# Altium project Booster_Main_Board.PrjPcb (part 4 of 4)

## Sheet TEMP_MGT.SchDoc: Temperature
size 420 x 297 mm; Author: G.K.; CompanyName: WUT; DrawnBy: G.K.; Organization: WUT; Address1: Warsaw Univeristy of Technology; Address2: Nowowiejska 15/19; DocumentNumber: 6; Revision: 1.6.2; SheetNumber: 6; SheetTotal: 6; EDA_Number: ARTIQ; Projet: Booster RF Power Amplifier; ModifiedBy: -; CreateDate: XX/XX/XXXX; CheckedDate: -; Title2: Management 1.6.2; DivGrp: ISE; Designer: G.K.; ModifiedDate: -; ProjectName: Booster RF Power Amplifier
Used 3 times, as channels U_Booster_TOP/U_TEMP_MGT1, U_Booster_TOP/U_TEMP_MGT2, U_Booster_TOP/U_TEMP_MGT3. Parts and nets are listed once, with the designators drawn on the sheet.
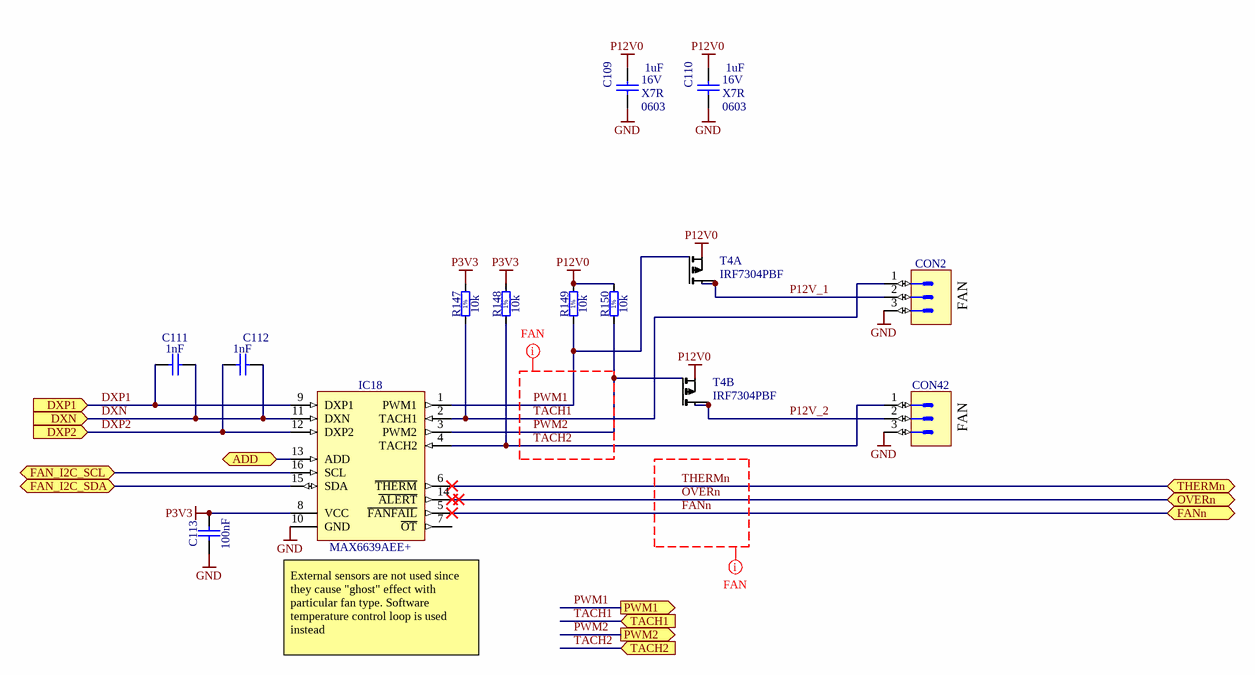
[diagram p5: TEMP_MGT.SchDoc]

### Parts
C109  1uF  Voltage: 16V  TC: X7R  Case: 0603  [CAPC1608X87N]
C110  1uF  Voltage: 16V  TC: X7R  Case: 0603  [CAPC1608X87N]
C111  1nF  [CAPC1608X87N]
C112  1nF  [CAPC1608X87N]
C113  100nF  [CAPC1005X55N]
CON2  KK®  [MOLEX_22-05-7038]  (value not drawn)
CON42  KK®  [MOLEX_22-05-7038]  (value not drawn)
IC18  MAX6639AEE+  [SOP63P600X175-16N]
R147  10k  [RESC1005X40N]
R148  10k  [RESC1005X40N]
R149  10k  [RESC1005X40N]
R150  10k  [RESC1005X40N]
T4  IRF7304PBF  [so-8]  (parts A,B of 2)

### Ports
ADD (bidir), DXN (in), DXP1 (in), DXP2 (in), FAN_I2C_SCL (bidir), FAN_I2C_SDA (bidir), FANn (bidir), OVERn (bidir), PWM1 (out), PWM2 (out), TACH1 (in), TACH2 (in), THERMn (bidir)

### Nets
GND: C109.1 C110.1 C113.1 CON2.3 CON42.3 IC18.10(GND)
P3V3: C113.2 IC18.8(VCC) R147.2 R148.2
P12V0: C109.2 C110.2 R149.2 R150.2 T4.1(S1) T4.3(S2)
ADD: IC18.13(ADD) ; port ADD
DXN: C111.1 C112.1 IC18.11(DXN) ; port DXN
DXP1: C111.2 IC18.9(DXP1) ; port DXP1
DXP2: C112.2 IC18.12(DXP2) ; port DXP2
FAN_I2C_SCL: IC18.16(SCL) ; port FAN_I2C_SCL
FAN_I2C_SDA: IC18.15(SDA) ; port FAN_I2C_SDA
FANn: IC18.5(~{FANFAIL}) ; port FANn
OVERn: IC18.14(~{ALERT}) ; port OVERn
P12V_1: CON2.2 T4.7(D1) T4.8(D1)
P12V_2: CON42.2 T4.5(D2) T4.6(D2)
PWM1: IC18.1(PWM1) R149.1 T4.2(G1) ; port PWM1
PWM2: IC18.3(PWM2) R150.1 T4.4(G2) ; port PWM2
TACH1: CON2.1 IC18.2(TACH1) R147.1 ; port TACH1
TACH2: CON42.1 IC18.4(TACH2) R148.1 ; port TACH2
THERMn: IC18.6(~{THERM}) ; port THERMn

Not connected (* = marked no-connect by the designer): IC18 7(~{OT})

### Channels
U_Booster_TOP/U_TEMP_MGT1: designators end in _1; ports ADD=NetIC18_1_13 DXN=DXN DXP1=DXP1 DXP2=DXP2 FAN_I2C_SCL=NetIC18_1_16 FAN_I2C_SDA=NetIC18_1_15 FANn=FANn OVERn=OVERn PWM1=PWM1 PWM2=PWM2 TACH1=TACH1 TACH2=TACH2 THERMn=THERMn
U_Booster_TOP/U_TEMP_MGT2: designators end in _2; ports ADD=NetIC18_1_13 DXN=DXN DXP1=DXP1 DXP2=DXP2 FAN_I2C_SCL=NetIC18_1_16 FAN_I2C_SDA=NetIC18_1_15 FANn=FANn OVERn=OVERn PWM1=PWM1 PWM2=PWM2 TACH1=TACH1 TACH2=TACH2 THERMn=THERMn
U_Booster_TOP/U_TEMP_MGT3: designators end in _3; ports ADD=NetIC18_1_13 DXN=DXN DXP1=DXP1 DXP2=DXP2 FAN_I2C_SCL=NetIC18_1_16 FAN_I2C_SDA=NetIC18_1_15 FANn=FANn OVERn=OVERn PWM1=PWM1 PWM2=PWM2 TACH1=TACH1 TACH2=TACH2 THERMn=THERMn

### Layout directives
net class FAN: FANn, OVERn, PWM1, PWM2, TACH1, TACH2, THERMn

### Notes on the sheet
- (near CON2) FAN
- (near CON42) FAN
- (near IC18) External sensors are not used since they cause "ghost" effect with particular fan type. Software temperature control loop is used instead
- Project/Equipment
- Document
- Designer
- Drawn by
- Check.by
- File
- Last Mod.
- Print Date
- Sheet
- Size
- A3
- of
- Rev
- (in symbol R0402_10K_1%_0.0625W_100PPM) 1%

### Library data of the parts
C109 C110 = CC0603_1UF_16V_10%_X7R: Non-polarised capacitor; Part Description: SMD Multilayer Chip Ceramic Capacitor; Manufacturer: GENERIC; Manufacturer1 Part Number: 223824613663; Tolerance: ±10%; Table: Capacitors SMD; Part Number: CC0603_1UF_16V_10%_X7R; Component Kind: Standard; Component Type: Standard; Pin Count: 2; Value: 1uF; Status: Preferred; Manufacturer Part Number: CC0603_1uF_16V_10%_X7R; Mounted: Yes; Socket: No; SMD: Yes; Manufacturer1 Example: PHYCOMP; Manufacturer1 ComponentHeight: 0.87mm; HelpURL: \\cern.ch\dfs\Applications\Altium\Datasheets\CC0805_X5R_PHYCOMP_HC.pdf; Author: CERN DEM JLC; CreateDate: 12/3/2007; LatestRevisionDate: 12/3/2007
C111 C112 = CC0603_1NF_50V_10%_X7R: Non-polarised capacitor; Part Description: SMD Multilayer Chip Ceramic Capacitor; Manufacturer: GENERIC; Manufacturer1 Part Number: 223858615623; Voltage: 50V; TC: X7R; Tolerance: ±10%; Table: Capacitors SMD; Part Number: CC0603_1NF_50V_10%_X7R; Component Kind: Standard; Component Type: Standard; Pin Count: 2; Value: 1nF; Status: Preferred; Manufacturer Part Number: CC0603_1NF_50V_10%_X7R; Case: 0603; Mounted: Yes; Socket: No; SMD: Yes; Manufacturer1 Example: PHYCOMP; Manufacturer1 ComponentHeight: 0.87mm; HelpURL: \\cern.ch\dfs\Applications\Altium\Datasheets\CC0603_X7R_PHYCOMP.pdf; Author: CERN DEM JLC; CreateDate: 2007-12-03; LatestRevisionDate: 2007-12-03
C113 = CC0402_100NF_16V_10%_X7R: Non-polarised capacitor; Part Description: SMD Multilayer Chip Ceramic Capacitor; Manufacturer: GENERIC; Manufacturer1 Part Number: GRM155R71C104KA88D; Voltage: 16V; TC: X7R; Tolerance: ±10%; Part Number: CC0402_100NF_16V_10%_X7R; Component Kind: Standard; Component Type: Standard; Pin Count: 2; Value: 100nF; Status: Not Recommended; Manufacturer Part Number: CC0402_100NF_16V_10%_X7R; Case: 0402; Mounted: Yes; Socket: No; SMD: Yes; Manufacturer1 Example: MURATA; Manufacturer1 ComponentHeight: 0.55mm; HelpURL: \\cern.ch\dfs\Applications\Altium\Datasheets\CC0402_X7R_MURATA_GRM.pdf; Author: CERN DEM JLC; CreateDate: 05.12.2013; LatestRevisionDate: 03.12.2007; Sense: No
CON2 CON42 = MOLEX_22-05-7038: Connector 3 Male; Part Description: 2.54mm (.100") Pitch KK® Wire-To-Board Header, Right Angle, With Friction Lock, 3 Circuits; Manufacturer: MOLEX; PressFit: No; Part Number: MOLEX_22-05-7038; Component Kind: Standard; Component Type: Standard; Pin Count: 3; Family: KK®; Mounted: Yes; Socket: No; SMD: No; Sense: No; Status: None; Manufacturer Part Number: 22-05-7038; ComponentHeight: 5.8mm; HelpURL: \\cern.ch\dfs\Applications\Altium\Datasheets\MOLEX_22-05-7038.pdf; Author: CERN DEM JLC; CreateDate: 19/09/2012; LatestRevisionDate: 19/09/2012
IC18 = MAX6639AEE+: 2-Channel Temperature Monitor with Dual, Automatic, PWM Fan-Speed Controller; Manufacturer: MAXIM; Table: Analog & Interface; Part Number: MAX6639AEE+; Component Kind: Standard; Component Type: Standard; Device: MAX6639AEE+; PackageDescription: SOP, 0.635mm pitch; 16 pin, 3.9mm W X 4.895mm L X 1.75mm H Body, IPC Medium Density; Part Description: 2-Channel Temperature Monitor with Dual, Automatic, PWM Fan-Speed Controller; Manufacturer Part Number: MAX6639AEE+; Pin Count: 16; Case: SSOP16; Mounted: Yes; Socket: No; SMD: Yes; ComponentHeight: 1.75mm; Author: CERN DEM JLC; HelpURL: \\cern.ch\dfs\Applications\Altium\Datasheets\MAX6639AEE+.pdf; CreateDate: 2012-08-15; LatestRevisionDate: 2012-08-15
R147-R150 = R0402_10K_1%_0.0625W_100PPM: Resistor - 1%; Part Description: General Purpose Thick Film Chip Resistor; Manufacturer: GENERIC; Manufacturer1 Part Number: 232270671003L; TC: ±100ppm/°C; Table: Resistors SMD; Part Number: R0402_10K_1%_0.0625W_100PPM; Component Kind: Standard; Component Type: Standard; Pin Count: 2; Value: 10k; Status: Not recommended; Power: 0.0625W; Tolerance: ±1%; Manufacturer Part Number: R0402_10K_1%_0.0625W_100PPM; Case: 0402; Mounted: Yes; Socket: No; SMD: Yes; Manufacturer1 Example: YAGEO PHYCOMP; Manufacturer1 ComponentHeight: 0.4mm; HelpURL: \\cern.ch\dfs\Applications\Altium\Datasheets\R0402_Phycomp_RC0402.pdf; Author: CERN DEM JLC; CreateDate: 2007-12-03; LatestRevisionDate: 2012-10-17
T4 = Q_IRF7304: dual PMOS   20V 4,3A 2,0W 0,09R; Manufacturer Part Number: IRF7304PBF

## Nets that join several sheets
GND: Booster_Main_Board (40 pins), CPU (44 pins), U_Booster_TOP/U_PA_Channel (69 pins), U_Booster_TOP/U_PA_Channel (69 pins), U_Booster_TOP/U_PA_Channel (69 pins), U_Booster_TOP/U_PA_Channel (69 pins), U_Booster_TOP/U_PA_Channel (69 pins), U_Booster_TOP/U_PA_Channel (69 pins), U_Booster_TOP/U_PA_Channel (69 pins), U_Booster_TOP/U_PA_Channel (69 pins), Power_Supply (76 pins), U_Booster_TOP/U_TEMP_MGT1 (6 pins), U_Booster_TOP/U_TEMP_MGT2 (6 pins), U_Booster_TOP/U_TEMP_MGT3 (6 pins)
N8V0: U_Booster_TOP/U_PA_Channel (C84_1.1 IC23_1.2 IC23_1.4), U_Booster_TOP/U_PA_Channel (C84_2.1 IC23_2.2 IC23_2.4), U_Booster_TOP/U_PA_Channel (C84_3.1 IC23_3.2 IC23_3.4), U_Booster_TOP/U_PA_Channel (C84_4.1 IC23_4.2 IC23_4.4), U_Booster_TOP/U_PA_Channel (C84_5.1 IC23_5.2 IC23_5.4), U_Booster_TOP/U_PA_Channel (C84_6.1 IC23_6.2 IC23_6.4), U_Booster_TOP/U_PA_Channel (C84_7.1 IC23_7.2 IC23_7.4), U_Booster_TOP/U_PA_Channel (C84_8.1 IC23_8.2 IC23_8.4), Power_Supply (C31.2 L4.2 R91.2 R108.1)
P3V3: Booster_Main_Board (38 pins), CPU (43 pins), U_Booster_TOP/U_PA_Channel (10 pins), U_Booster_TOP/U_PA_Channel (10 pins), U_Booster_TOP/U_PA_Channel (10 pins), U_Booster_TOP/U_PA_Channel (10 pins), U_Booster_TOP/U_PA_Channel (10 pins), U_Booster_TOP/U_PA_Channel (10 pins), U_Booster_TOP/U_PA_Channel (10 pins), U_Booster_TOP/U_PA_Channel (10 pins), Power_Supply (18 pins), U_Booster_TOP/U_TEMP_MGT1 (C113_1.2 IC18_1.8 R147_1.2 R148_1.2), U_Booster_TOP/U_TEMP_MGT2 (C113_2.2 IC18_2.8 R147_2.2 R148_2.2), U_Booster_TOP/U_TEMP_MGT3 (C113_3.2 IC18_3.8 R147_3.2 R148_3.2)
P5V0: U_Booster_TOP/U_PA_Channel (F1_1.1), U_Booster_TOP/U_PA_Channel (F1_2.1), U_Booster_TOP/U_PA_Channel (F1_3.1), U_Booster_TOP/U_PA_Channel (F1_4.1), U_Booster_TOP/U_PA_Channel (F1_5.1), U_Booster_TOP/U_PA_Channel (F1_6.1), U_Booster_TOP/U_PA_Channel (F1_7.1), U_Booster_TOP/U_PA_Channel (F1_8.1), Power_Supply (9 pins)
P6V5: U_Booster_TOP/U_PA_Channel (C78_1.1 C89_1.1 IC13_1.2 IC21_1.2), U_Booster_TOP/U_PA_Channel (C78_2.1 C89_2.1 IC13_2.2 IC21_2.2), U_Booster_TOP/U_PA_Channel (C78_3.1 C89_3.1 IC13_3.2 IC21_3.2), U_Booster_TOP/U_PA_Channel (C78_4.1 C89_4.1 IC13_4.2 IC21_4.2), U_Booster_TOP/U_PA_Channel (C78_5.1 C89_5.1 IC13_5.2 IC21_5.2), U_Booster_TOP/U_PA_Channel (C78_6.1 C89_6.1 IC13_6.2 IC21_6.2), U_Booster_TOP/U_PA_Channel (C78_7.1 C89_7.1 IC13_7.2 IC21_7.2), U_Booster_TOP/U_PA_Channel (C78_8.1 C89_8.1 IC13_8.2 IC21_8.2), Power_Supply (9 pins)
P12V0: Power_Supply (11 pins), U_Booster_TOP/U_TEMP_MGT1 (6 pins), U_Booster_TOP/U_TEMP_MGT2 (6 pins), U_Booster_TOP/U_TEMP_MGT3 (6 pins)
P30V0: U_Booster_TOP/U_PA_Channel (C32_1.2 R17_1.2 R114_1.1 U1_1.1), U_Booster_TOP/U_PA_Channel (C32_2.2 R17_2.2 R114_2.1 U1_2.1), U_Booster_TOP/U_PA_Channel (C32_3.2 R17_3.2 R114_3.1 U1_3.1), U_Booster_TOP/U_PA_Channel (C32_4.2 R17_4.2 R114_4.1 U1_4.1), U_Booster_TOP/U_PA_Channel (C32_5.2 R17_5.2 R114_5.1 U1_5.1), U_Booster_TOP/U_PA_Channel (C32_6.2 R17_6.2 R114_6.1 U1_6.1), U_Booster_TOP/U_PA_Channel (C32_7.2 R17_7.2 R114_7.1 U1_7.1), U_Booster_TOP/U_PA_Channel (C32_8.2 R17_8.2 R114_8.1 U1_8.1), Power_Supply (5 pins)
REF_P3V3: U_Booster_TOP/U_PA_Channel (C60_1.2 IC15_1.3 R89_1.2 T5_1.2), U_Booster_TOP/U_PA_Channel (C60_2.2 IC15_2.3 R89_2.2 T5_2.2), U_Booster_TOP/U_PA_Channel (C60_3.2 IC15_3.3 R89_3.2 T5_3.2), U_Booster_TOP/U_PA_Channel (C60_4.2 IC15_4.3 R89_4.2 T5_4.2), U_Booster_TOP/U_PA_Channel (C60_5.2 IC15_5.3 R89_5.2 T5_5.2), U_Booster_TOP/U_PA_Channel (C60_6.2 IC15_6.3 R89_6.2 T5_6.2), U_Booster_TOP/U_PA_Channel (C60_7.2 IC15_7.3 R89_7.2 T5_7.2), U_Booster_TOP/U_PA_Channel (C60_8.2 IC15_8.3 R89_8.2 T5_8.2), Power_Supply (6 pins)
ALERT: U_Booster_TOP/U_PA_Channel (IC9_1.2 LD4_1.1 R57_1.1), U_Booster_TOP/U_PA_Channel (IC9_2.2 LD4_2.1 R57_2.1), U_Booster_TOP/U_PA_Channel (IC9_3.2 LD4_3.1 R57_3.1), U_Booster_TOP/U_PA_Channel (IC9_4.2 LD4_4.1 R57_4.1), U_Booster_TOP/U_PA_Channel (IC9_5.2 LD4_5.1 R57_5.1), U_Booster_TOP/U_PA_Channel (IC9_6.2 LD4_6.1 R57_6.1), U_Booster_TOP/U_PA_Channel (IC9_7.2 LD4_7.1 R57_7.1), U_Booster_TOP/U_PA_Channel (IC9_8.2 LD4_8.1 R57_8.1)
DXN: U_Booster_TOP/U_TEMP_MGT1 (C111_1.1 C112_1.1 IC18_1.11), U_Booster_TOP/U_TEMP_MGT2 (C111_2.1 C112_2.1 IC18_2.11), U_Booster_TOP/U_TEMP_MGT3 (C111_3.1 C112_3.1 IC18_3.11)
DXP1: U_Booster_TOP/U_TEMP_MGT1 (C111_1.2 IC18_1.9), U_Booster_TOP/U_TEMP_MGT2 (C111_2.2 IC18_2.9), U_Booster_TOP/U_TEMP_MGT3 (C111_3.2 IC18_3.9)
DXP2: U_Booster_TOP/U_TEMP_MGT1 (C112_1.2 IC18_1.12), U_Booster_TOP/U_TEMP_MGT2 (C112_2.2 IC18_2.12), U_Booster_TOP/U_TEMP_MGT3 (C112_3.2 IC18_3.12)
FANn: CPU (IC1.45 R133.1), U_Booster_TOP/U_TEMP_MGT1 (IC18_1.5), U_Booster_TOP/U_TEMP_MGT2 (IC18_2.5), U_Booster_TOP/U_TEMP_MGT3 (IC18_3.5)
NetC83_1_1: U_Booster_TOP/U_PA_Channel (C83_1.1 J1_1.1), U_Booster_TOP/U_PA_Channel (C83_2.1 J1_2.1), U_Booster_TOP/U_PA_Channel (C83_3.1 J1_3.1), U_Booster_TOP/U_PA_Channel (C83_4.1 J1_4.1), U_Booster_TOP/U_PA_Channel (C83_5.1 J1_5.1), U_Booster_TOP/U_PA_Channel (C83_6.1 J1_6.1), U_Booster_TOP/U_PA_Channel (C83_7.1 J1_7.1), U_Booster_TOP/U_PA_Channel (C83_8.1 J1_8.1)
NetD2_1_1: U_Booster_TOP/U_PA_Channel (D2_1.1), U_Booster_TOP/U_PA_Channel (D2_2.1), U_Booster_TOP/U_PA_Channel (D2_3.1), U_Booster_TOP/U_PA_Channel (D2_4.1), U_Booster_TOP/U_PA_Channel (D2_5.1), U_Booster_TOP/U_PA_Channel (D2_6.1), U_Booster_TOP/U_PA_Channel (D2_7.1), U_Booster_TOP/U_PA_Channel (D2_8.1)
NetD15_2: CPU (IC1.89), Power_Supply (7 pins)
NetIC1_90: CPU (IC1.90), U_Booster_TOP/U_PA_Channel (IC9_1.1), U_Booster_TOP/U_PA_Channel (IC9_2.1), U_Booster_TOP/U_PA_Channel (IC9_3.1), U_Booster_TOP/U_PA_Channel (IC9_4.1), U_Booster_TOP/U_PA_Channel (IC9_5.1), U_Booster_TOP/U_PA_Channel (IC9_6.1), U_Booster_TOP/U_PA_Channel (IC9_7.1), U_Booster_TOP/U_PA_Channel (IC9_8.1)
NetIC18_1_13: U_Booster_TOP/U_TEMP_MGT1 (IC18_1.13), U_Booster_TOP/U_TEMP_MGT2 (IC18_2.13), U_Booster_TOP/U_TEMP_MGT3 (IC18_3.13)
NetIC18_1_15: U_Booster_TOP/U_TEMP_MGT1 (IC18_1.15), U_Booster_TOP/U_TEMP_MGT2 (IC18_2.15), U_Booster_TOP/U_TEMP_MGT3 (IC18_3.15)
NetIC18_1_16: U_Booster_TOP/U_TEMP_MGT1 (IC18_1.16), U_Booster_TOP/U_TEMP_MGT2 (IC18_2.16), U_Booster_TOP/U_TEMP_MGT3 (IC18_3.16)
NetR50_1_1: U_Booster_TOP/U_PA_Channel (R50_1.1 R84_1.2), U_Booster_TOP/U_PA_Channel (R50_2.1 R84_2.2), U_Booster_TOP/U_PA_Channel (R50_3.1 R84_3.2), U_Booster_TOP/U_PA_Channel (R50_4.1 R84_4.2), U_Booster_TOP/U_PA_Channel (R50_5.1 R84_5.2), U_Booster_TOP/U_PA_Channel (R50_6.1 R84_6.2), U_Booster_TOP/U_PA_Channel (R50_7.1 R84_7.2), U_Booster_TOP/U_PA_Channel (R50_8.1 R84_8.2)
NetR85_1_2: U_Booster_TOP/U_PA_Channel (R85_1.2 R88_1.2), U_Booster_TOP/U_PA_Channel (R85_2.2 R88_2.2), U_Booster_TOP/U_PA_Channel (R85_3.2 R88_3.2), U_Booster_TOP/U_PA_Channel (R85_4.2 R88_4.2), U_Booster_TOP/U_PA_Channel (R85_5.2 R88_5.2), U_Booster_TOP/U_PA_Channel (R85_6.2 R88_6.2), U_Booster_TOP/U_PA_Channel (R85_7.2 R88_7.2), U_Booster_TOP/U_PA_Channel (R85_8.2 R88_8.2)
OVERn: CPU (IC1.56), U_Booster_TOP/U_TEMP_MGT1 (IC18_1.14), U_Booster_TOP/U_TEMP_MGT2 (IC18_2.14), U_Booster_TOP/U_TEMP_MGT3 (IC18_3.14)
PGOOD_N7V5: CPU (IC1.57), Power_Supply (IC5.8 R25.2 TP1.1)
PWM1: U_Booster_TOP/U_TEMP_MGT1 (IC18_1.1 R149_1.1 T4_1.2), U_Booster_TOP/U_TEMP_MGT2 (IC18_2.1 R149_2.1 T4_2.2), U_Booster_TOP/U_TEMP_MGT3 (IC18_3.1 R149_3.1 T4_3.2)
PWM2: U_Booster_TOP/U_TEMP_MGT1 (IC18_1.3 R150_1.1 T4_1.4), U_Booster_TOP/U_TEMP_MGT2 (IC18_2.3 R150_2.1 T4_2.4), U_Booster_TOP/U_TEMP_MGT3 (IC18_3.3 R150_3.1 T4_3.4)
Refl_overdrive: U_Booster_TOP/U_PA_Channel (C82_1.1 J1_1.3 R34_1.1), U_Booster_TOP/U_PA_Channel (C82_2.1 J1_2.3 R34_2.1), U_Booster_TOP/U_PA_Channel (C82_3.1 J1_3.3 R34_3.1), U_Booster_TOP/U_PA_Channel (C82_4.1 J1_4.3 R34_4.1), U_Booster_TOP/U_PA_Channel (C82_5.1 J1_5.3 R34_5.1), U_Booster_TOP/U_PA_Channel (C82_6.1 J1_6.3 R34_6.1), U_Booster_TOP/U_PA_Channel (C82_7.1 J1_7.3 R34_7.1), U_Booster_TOP/U_PA_Channel (C82_8.1 J1_8.3 R34_8.1)
SCL: U_Booster_TOP/U_PA_Channel (C81_1.1 IC9_1.3 IC15_1.5 J1_1.9), U_Booster_TOP/U_PA_Channel (C81_2.1 IC9_2.3 IC15_2.5 J1_2.9), U_Booster_TOP/U_PA_Channel (C81_3.1 IC9_3.3 IC15_3.5 J1_3.9), U_Booster_TOP/U_PA_Channel (C81_4.1 IC9_4.3 IC15_4.5 J1_4.9), U_Booster_TOP/U_PA_Channel (C81_5.1 IC9_5.3 IC15_5.5 J1_5.9), U_Booster_TOP/U_PA_Channel (C81_6.1 IC9_6.3 IC15_6.5 J1_6.9), U_Booster_TOP/U_PA_Channel (C81_7.1 IC9_7.3 IC15_7.5 J1_7.9), U_Booster_TOP/U_PA_Channel (C81_8.1 IC9_8.3 IC15_8.5 J1_8.9)
SDA: U_Booster_TOP/U_PA_Channel (C80_1.1 IC9_1.4 IC15_1.4 J1_1.4), U_Booster_TOP/U_PA_Channel (C80_2.1 IC9_2.4 IC15_2.4 J1_2.4), U_Booster_TOP/U_PA_Channel (C80_3.1 IC9_3.4 IC15_3.4 J1_3.4), U_Booster_TOP/U_PA_Channel (C80_4.1 IC9_4.4 IC15_4.4 J1_4.4), U_Booster_TOP/U_PA_Channel (C80_5.1 IC9_5.4 IC15_5.4 J1_5.4), U_Booster_TOP/U_PA_Channel (C80_6.1 IC9_6.4 IC15_6.4 J1_6.4), U_Booster_TOP/U_PA_Channel (C80_7.1 IC9_7.4 IC15_7.4 J1_7.4), U_Booster_TOP/U_PA_Channel (C80_8.1 IC9_8.4 IC15_8.4 J1_8.4)
TACH1: U_Booster_TOP/U_TEMP_MGT1 (CON2_1.1 IC18_1.2 R147_1.1), U_Booster_TOP/U_TEMP_MGT2 (CON2_2.1 IC18_2.2 R147_2.1), U_Booster_TOP/U_TEMP_MGT3 (CON2_3.1 IC18_3.2 R147_3.1)
TACH2: U_Booster_TOP/U_TEMP_MGT1 (CON42_1.1 IC18_1.4 R148_1.1), U_Booster_TOP/U_TEMP_MGT2 (CON42_2.1 IC18_2.4 R148_2.1), U_Booster_TOP/U_TEMP_MGT3 (CON42_3.1 IC18_3.4 R148_3.1)
THERMn: CPU (IC1.44 R132.1), U_Booster_TOP/U_TEMP_MGT1 (IC18_1.6), U_Booster_TOP/U_TEMP_MGT2 (IC18_2.6), U_Booster_TOP/U_TEMP_MGT3 (IC18_3.6)
U_RFL_PWR: U_Booster_TOP/U_PA_Channel (C79_1.1 J1_1.10), U_Booster_TOP/U_PA_Channel (C79_2.1 J1_2.10), U_Booster_TOP/U_PA_Channel (C79_3.1 J1_3.10), U_Booster_TOP/U_PA_Channel (C79_4.1 J1_4.10), U_Booster_TOP/U_PA_Channel (C79_5.1 J1_5.10), U_Booster_TOP/U_PA_Channel (C79_6.1 J1_6.10), U_Booster_TOP/U_PA_Channel (C79_7.1 J1_7.10), U_Booster_TOP/U_PA_Channel (C79_8.1 J1_8.10)
U_TX_PWR: U_Booster_TOP/U_PA_Channel (C73_1.1 J1_1.5), U_Booster_TOP/U_PA_Channel (C73_2.1 J1_2.5), U_Booster_TOP/U_PA_Channel (C73_3.1 J1_3.5), U_Booster_TOP/U_PA_Channel (C73_4.1 J1_4.5), U_Booster_TOP/U_PA_Channel (C73_5.1 J1_5.5), U_Booster_TOP/U_PA_Channel (C73_6.1 J1_6.5), U_Booster_TOP/U_PA_Channel (C73_7.1 J1_7.5), U_Booster_TOP/U_PA_Channel (C73_8.1 J1_8.5)

## Assembly variants
std: not fitted C19_1 C19_2 C19_3 C19_4 C19_5 C19_6 C19_7 C19_8 C55 C67_1 C67_2 C67_3 C67_4 C67_5 C67_6 C67_7 C67_8 C80_1 C80_2 C80_3 C80_4 C80_5 C80_6 C80_7 C80_8 C81_1 C81_2 C81_3 C81_4 C81_5 C81_6 C81_7 C81_8 C82_1 C82_2 C82_3 C82_4 C82_5 C82_6 C82_7 C82_8 C83_1 C83_2 C83_3 C83_4 C83_5 C83_6 C83_7 C83_8 C90_1 C90_2 C90_3 C90_4 C90_5 C90_6 C90_7 C90_8 CON2_3 IC12 IC21_1 IC21_2 IC21_3 IC21_4 IC21_5 IC21_6 IC21_7 IC21_8 IC24 L2 R10_1 R10_2 R10_3 R10_4 R10_5 R10_6 R10_7 R10_8 R13_1 R13_2 R13_3 R13_4 R13_5 R13_6 R13_7 R13_8 R81 R82 R122_1 R122_2 R122_3 R122_4 R122_5 R122_6 R122_7 R122_8 R123_1 R123_2 R123_3 R123_4 R123_5 R123_6 R123_7 R123_8 R126 R127 R130 R131